# Altium schematic sheet Peripherals.SchDoc
size A3; PageSetup: Record=PageOptions|CenterHorizontal=True|CenterVertical=True|PrintScale=0.49|XCorrection=1.00|YCorrection=1.00|PrintKind=0|BorderSize=5000000|LeftOffset=0|BottomOffset=0|Orientation=2|PaperLength=1000|PaperWidth=1000|Scale=100|PaperSource=7|PrintQuality=600|MediaType=1|DitherType=10|PaperKind=A3|PrintScaleMode=1; SheetTitle: Sheet Title
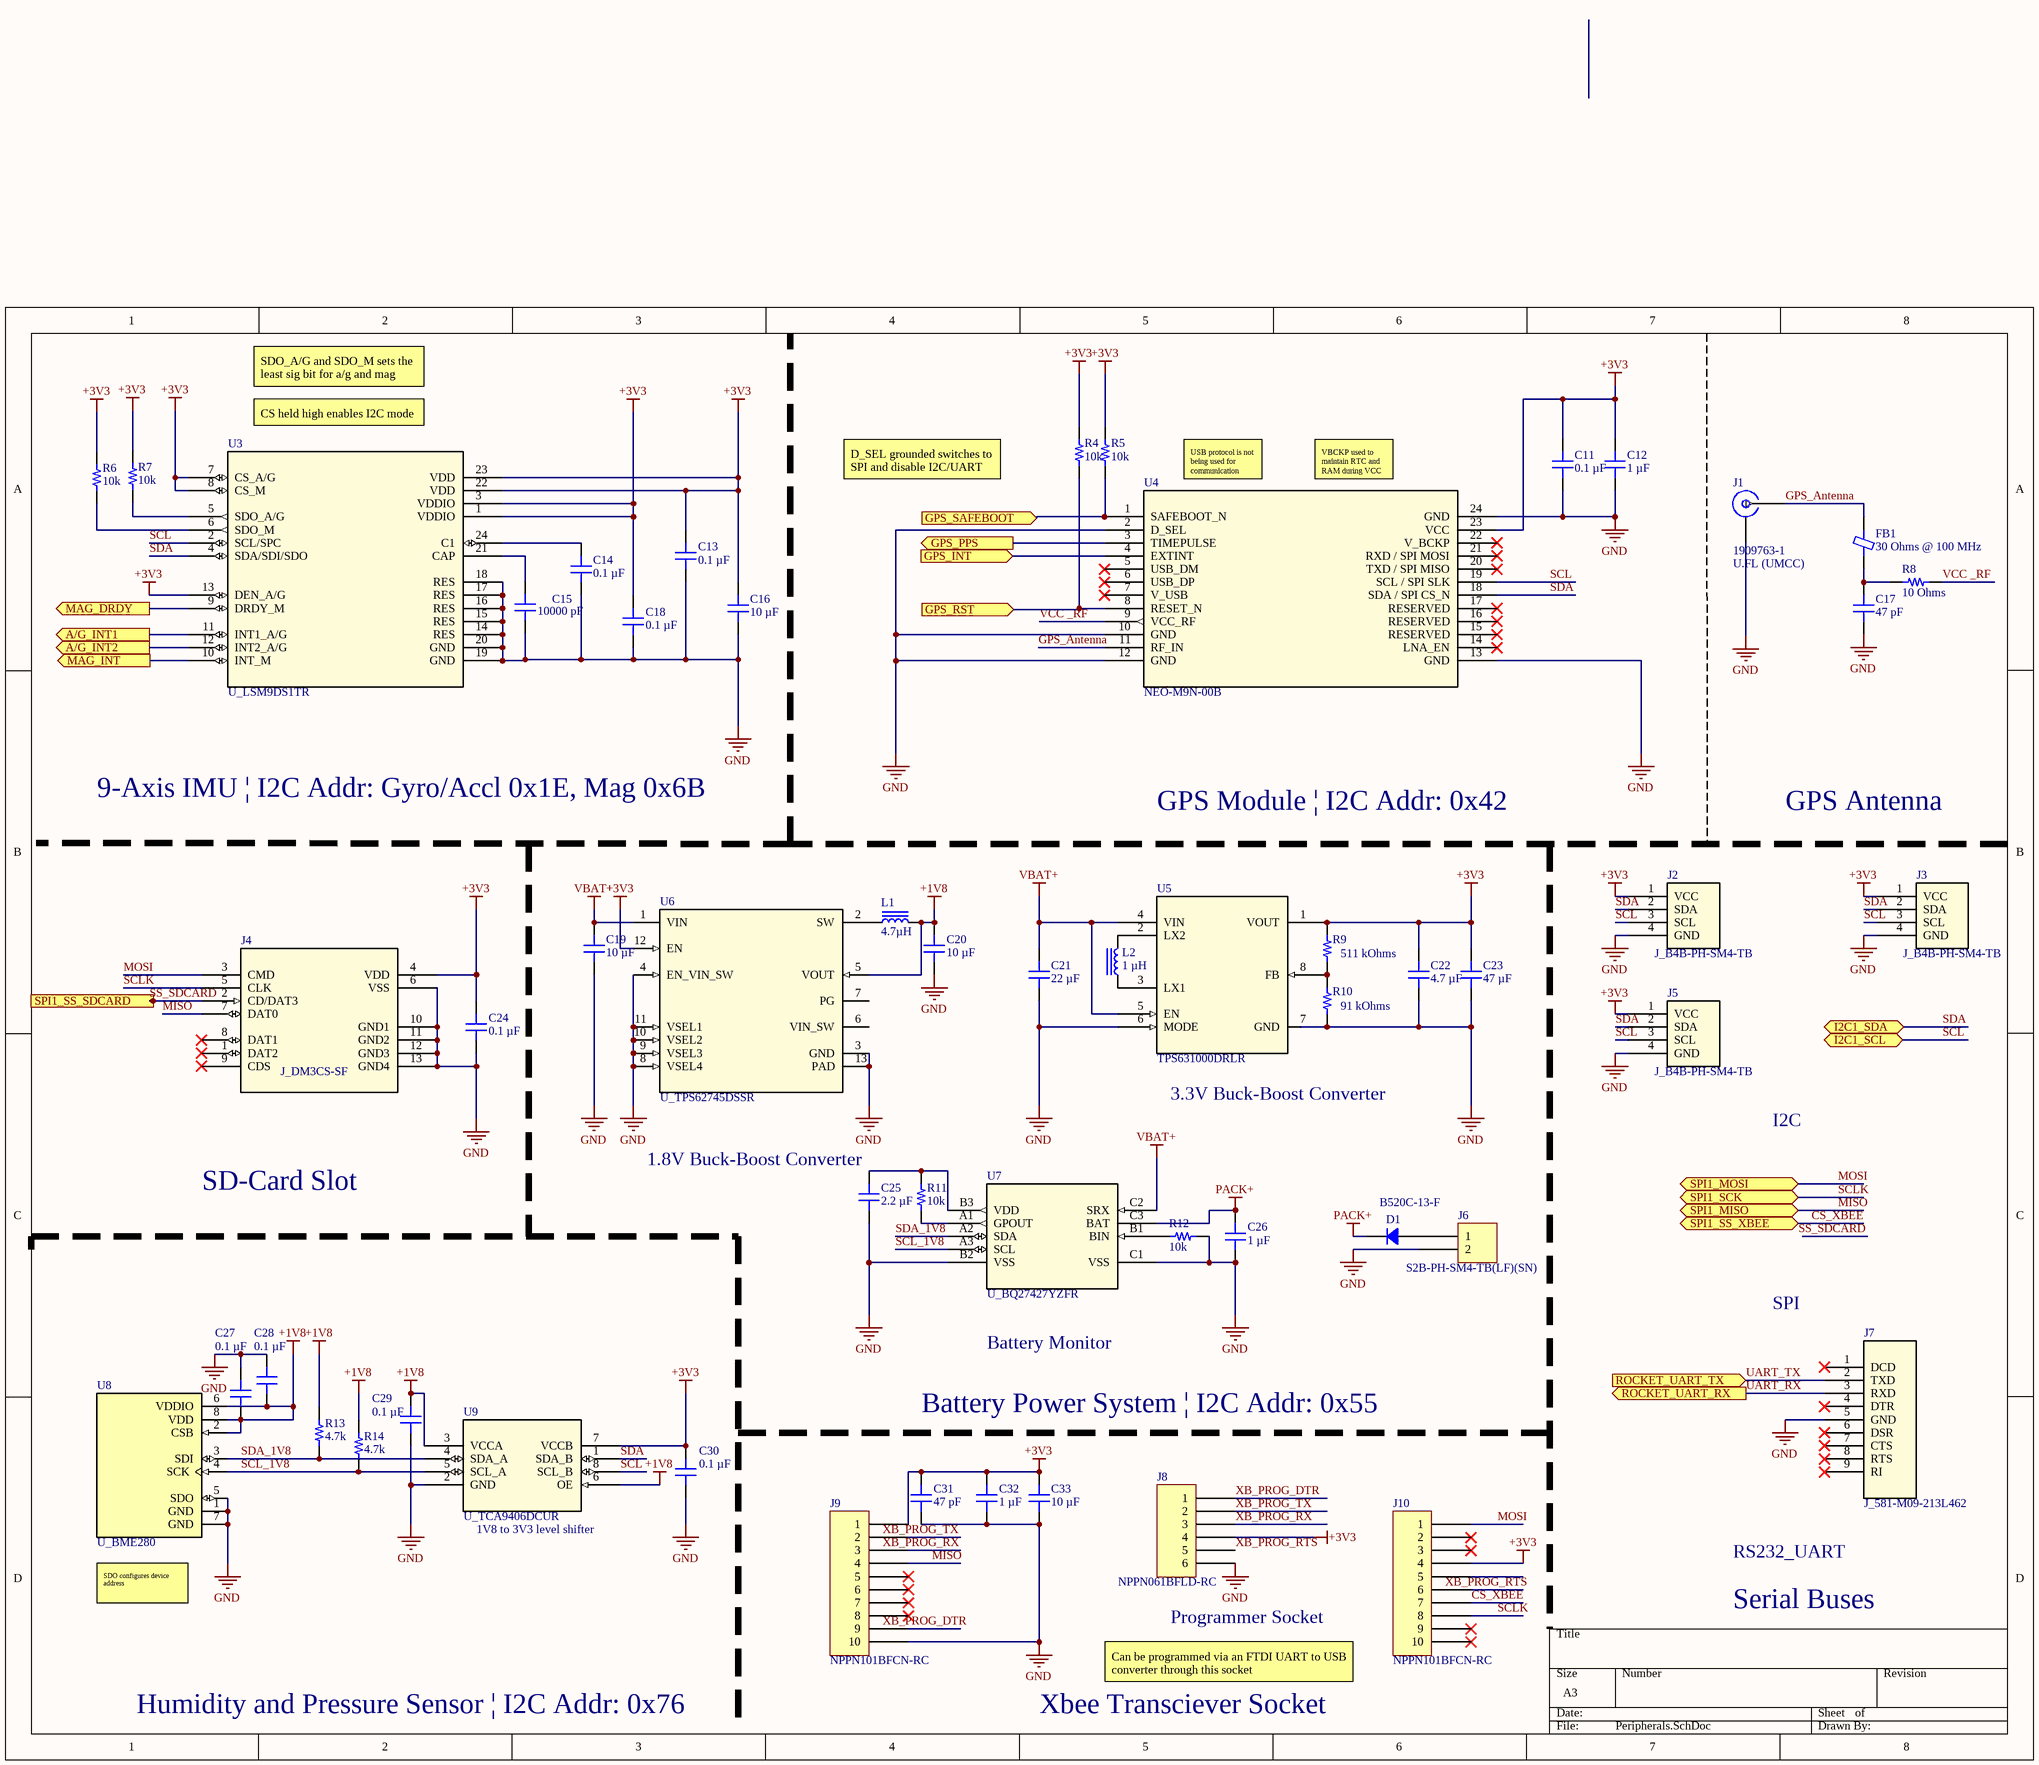
[diagram p0: Peripherals.SchDoc]

## Parts
C11  0.1 µF  [CAP 0402_1005]
C12  1 µF  [CAP 0402_1005]
C13  0.1 µF  [CAP 0201_0603]
C14  0.1 µF  [CAP 0402_1005]
C15  10000 pF  [CAP 0402_1005]
C16  10 µF  [CAP 0402_1005]
C17  47 pF  [CAP 0402_1005]
C18  0.1 µF  [CAP 0201_0603]
C19  10 µF  [CAP 0402_1005]
C20  10 µF  [CAP 0402_1005]
C21  22 µF  [CAP 0402_1005]
C22  4.7 µF  [CAP 0603_1608]
C23  47 µF  [CAP 0805_2012]
C24  0.1 µF  [CAP 0402_1005]
C25  2.2 µF  [CAP 0402_1005]
C26  1 µF  [CAP 0402_1005]
C27  0.1 µF  [CAP 0402_1005]
C28  0.1 µF  [CAP 0402_1005]
C29  0.1 µF  [CAP 0402_1005]
C30  0.1 µF  [CAP 0402_1005]
C31  47 pF  [CAP 0402_1005]
C32  1 µF  [CAP 0402_1005]
C33  10 µF  [CAP 0402_1005]
D1  B520C-13-F  [DO214AB SMC]
FB1  30 Ohms @ 100 MHz  [FER 0402_1005]
J1  1909763-1  Connector Style: U.FL (UMCC)  [TE C-1909763]
J2  J_B4B-PH-SM4-TB  [CONN_B4B-PH-SM4-TB_JST]
J3  J_B4B-PH-SM4-TB  [CONN_B4B-PH-SM4-TB_JST]
J4  J_DM3CS-SF  [DM3CS-SF_HIR]
J5  J_B4B-PH-SM4-TB  [CONN_B4B-PH-SM4-TB_JST]
J6  S2B-PH-SM4-TB(LF)(SN)  [JST S2B-PH-SM4-TB]
J7  J_581-M09-213L462  [CONN_581-M09-213L462_NRC]
J8  NPPN061BFLD-RC  [SULLINS NPPN061BFLD-RC]
J9  NPPN101BFCN-RC  [SULLINS NPPN101BFCN]
J10  NPPN101BFCN-RC  [SULLINS NPPN101BFCN]
L1  4.7µH  [IND 0603_1608 RF WW]
L2  1 µH  [IND 0806_2016]
R4  10k  [RES 0402_1005]
R5  10k  [RES 0402_1005]
R6  10k  [RES 0402_1005]
R7  10k  [RES 0402_1005]
R8  10 Ohms  [RES 0402_1005]
R9  511 kOhms  [RES 0402_1005]
R10  91 kOhms  [RES 0402_1005]
R11  10k  [RES 0402_1005]
R12  10k  [RES 0402_1005]
R13  4.7k  [RES 0201_0603]
R14  4.7k  [RES 0201_0603]
U3  U_LSM9DS1TR  [LGA-24_3X3P5X1_STM]
U4  NEO-M9N-00B  [XCVR_NEO-M9N-00B]
U5  TPS631000DRLR  [TPS631000DRLR_TEX]
U6  U_TPS62745DSSR  [DSS0012A]
U7  U_BQ27427YZFR  [DSBGA9-YZF_TEX]
U8  U_BME280  [BME280]
U9  U_TCA9406DCUR  [DCU8]

## Ports
A/G_INT1 (out), A/G_INT2 (out), GPS_INT (in), GPS_PPS (out), GPS_RST (in), GPS_SAFEBOOT (in), I2C1_SCL (bidir), I2C1_SDA (bidir), MAG_DRDY (out), MAG_INT (out), ROCKET_UART_RX (out), ROCKET_UART_TX (in), SPI1_MISO (bidir), SPI1_MOSI (bidir), SPI1_SCK (bidir), SPI1_SS_SDCARD (in), SPI1_SS_XBEE (bidir)

## Nets
+1V8: C20.2 C27.2 C28.2 C29.1 L1.2 R13.2 R14.2 U6.5(VOUT) U8.2(CSB) U8.6(VDDIO) U8.8(VDD) U9.3(VCCA) U9.6(OE)
+3V3: C11.1 C12.2 C13.2 C16.2 C18.2 C22.2 C23.2 C24.2 C30.1 C31.2 C32.2 C33.2 J2.1(VCC) J3.1(VCC) J4.4(VDD) J5.1(VCC) J8.4 J9.1 J10.4 R4.1 R5.1 R6.1 R7.1 R9.2 U3.1(VDDIO) U3.3(VDDIO) U3.7(CS_A/G) U3.8(CS_M) U3.13(DEN_A/G) U3.22(VDD) U3.23(VDD) U4.23(VCC) U5.1(VOUT) U6.12(EN) U9.7(VCCB)
GND: C11.2 C12.1 C13.1 C14.1 C15.1 C16.1 C17.1 C18.1 C19.1 C20.1 C21.1 C22.1 C23.1 C24.1 C25.1 C26.1 C27.1 C28.1 C29.2 C30.2 C31.1 C32.1 C33.1 J1.G(GND) J2.4(GND) J3.4(GND) J4.6(VSS) J4.10(GND1) J4.11(GND2) J4.12(GND3) J4.13(GND4) J5.4(GND) J6.2 J7.5(GND) J8.6 J9.10 R10.1 R12.1 U3.14(RES) U3.15(RES) U3.16(RES) U3.17(RES) U3.18(RES) U3.19(GND) U3.20(GND) U4.2(D_SEL) U4.10(GND) U4.12(GND) U4.13(GND) U4.24(GND) U5.6(MODE) U5.7(GND) U6.3(GND) U6.4(EN_VIN_SW) U6.8(VSEL4) U6.9(VSEL3) U6.10(VSEL2) U6.11(VSEL1) U6.13(PAD) U7.B2(VSS) U7.C1(VSS) U8.1(GND) U8.5(SDO) U8.7(GND) U9.2(GND)
PACK+: C26.2 D1.2 U7.C3(BAT)
VBAT+: C19.2 C21.2 U5.4(VIN) U5.5(EN) U6.1(VIN) U7.C2(SRX)
A/G_INT1: U3.11(INT1_A/G) ; port A/G_INT1
A/G_INT2: U3.12(INT2_A/G) ; port A/G_INT2
CS_XBEE: J10.7 ; port SPI1_SS_XBEE
GPS_Antenna: FB1.2 J1.S(SIGNAL) U4.11(RF_IN)
GPS_INT: U4.4(EXTINT) ; port GPS_INT
GPS_PPS: U4.3(TIMEPULSE) ; port GPS_PPS
GPS_RST: R4.2 U4.8(RESET_N) ; port GPS_RST
GPS_SAFEBOOT: R5.2 U4.1(SAFEBOOT_N) ; port GPS_SAFEBOOT
MAG_DRDY: U3.9(DRDY_M) ; port MAG_DRDY
MAG_INT: U3.10(INT_M) ; port MAG_INT
MISO: J4.7(DAT0) J9.4 ; port SPI1_MISO
MOSI: J4.3(CMD) J10.1 ; port SPI1_MOSI
SCL: J2.3(SCL) J3.3(SCL) J5.3(SCL) U3.2(SCL/SPC) U4.19(SCL_/_SPI_SLK) U9.8(SCL_B) ; port I2C1_SCL
SCL_1V8: R14.1 U7.A3(SCL) U8.4(SCK) U9.5(SCL_A)
SCLK: J4.5(CLK) J10.8 ; port SPI1_SCK
SDA: J2.2(SDA) J3.2(SDA) J5.2(SDA) U3.4(SDA/SDI/SDO) U4.18(SDA_/_SPI_CS_N) U9.1(SDA_B) ; port I2C1_SDA
SDA_1V8: R13.1 U7.A2(SDA) U8.3(SDI) U9.4(SDA_A)
SS_SDCARD: J4.2(CD/DAT3) ; port SPI1_SS_SDCARD
UART_RX: J7.3(RXD) ; port ROCKET_UART_RX
UART_TX: J7.2(TXD) ; port ROCKET_UART_TX
VCC _RF: R8.2 U4.9(VCC_RF)
XB_PROG_DTR: J8.1
XB_PROG_RTS: J8.5
XB_PROG_RX: J8.3
XB_PROG_TX: J8.2
NetC14_2: C14.2 U3.24(C1)
NetC15_2: C15.2 U3.21(CAP)
NetC17_2: C17.2 FB1.1 R8.1
NetC25_2: C25.2 R11.2 U7.B3(VDD)
NetD1_1: D1.1 J6.1
NetL1_1: L1.1 U6.2(SW)
NetL2_1: L2.1 U5.3(LX1)
NetL2_2: L2.2 U5.2(LX2)
NetR6_2: R6.2 U3.6(SDO_M)
NetR7_2: R7.2 U3.5(SDO_A/G)
NetR9_1: R9.1 R10.2 U5.8(FB)
NetR11_1: R11.1 U7.A1(GPOUT)
NetR12_2: R12.2 U7.B1(BIN)

Not connected (* = marked no-connect by the designer): J4 1(DAT2)* 8(DAT1)* 9(CDS)*; J7 1(DCD)* 4(DTR)* 6(DSR)* 7(CTS)* 8(RTS)* 9(RI)*; J9 2 3 5* 6* 7* 8* 9; J10 2* 3* 5 6 9* 10*; U4 5(USB_DM)* 6(USB_DP)* 7(V_USB)* 14(LNA_EN)* 15(RESERVED)* 16(RESERVED)* 17(RESERVED)* 20(TXD_/_SPI_MISO)* 21(RXD_/_SPI_MOSI)* 22(V_BCKP)*; U6 6(VIN_SW) 7(PG)

## Notes on the sheet
- SDO_A/G and SDO_M sets the least sig bit for a/g and mag
- CS held high enables I2C mode
- D_SEL grounded switches to SPI and disable I2C/UART
- (near U4) USB protocol is not being used for communication
- (near U4) VBCKP used to maintain RTC and RAM during VCC outage. Not being used as MCU does complete logging.
- 9-Axis IMU | I2C Addr: Gyro/Accl 0x1E, Mag 0x6B
- GPS Module | I2C Addr: 0x42
- GPS Antenna
- 3.3V Buck-Boost Converter
- I2C
- SD-Card Slot
- (near C25) 1.8V Buck-Boost Converter
- SPI
- Battery Monitor
- Battery Power System | I2C Addr: 0x55
- (near U9) 1V8 to 3V3 level shifter
- RS232_UART
- (near U8) SDO configures device address
- (near J8) Programmer Socket
- Serial Buses
- Humidity and Pressure Sensor | I2C Addr: 0x76
- Xbee Transciever Socket
- Can be programmed via an FTDI UART to USB converter through this socket
- Labels drawn without touching a wire or pin: SS_SDCARD, XB_PROG_DTR, XB_PROG_RTS, XB_PROG_RX, XB_PROG_TX

## Library data of the parts
C11 C14 C24 C27-C30 = CL05B104KP5VPNC: CAP CER 100NF 10V X7R 0402; manufacturer: Samsung Electro-Mechanics; Tolerance: ±10%; Part Number: CL05B104KP5VPNC; Value: 0.1 µF; Applications: Automotive; Capacitance: 0.1 µF; componentlink1description: Datasheet; componentlink1url: https://mm.digikey.com/Volume0/opasdata/d220001/medias/docus/5458/CL05B104KP5VPNC_Spec.pdf; componentlink2description: DigiKey Link; componentlink2url: https://www.digikey.com/en/products/detail/samsung-electro-mechanics/CL05B104KP5VPNC/20498482; Device Package: 0402 (1005 Metric); lastupdated: 9/02/2024 8:03:17 PM; Lifecycle Status: Active; Minimum Order: 1; Mounting Type: Surface Mount, MLCC; Operating Temperature: -55°C ~ 125°C; Package / Case: 0402 (1005 Metric); packaging: TapeAndReel; partid: 56690; price: 0.01; Ratings: AEC-Q200; series: CL; Size / Dimension: 0.039" L x 0.020" W (1.00mm x 0.50mm); Supplier 1: DigiKey; Supplier Part Number 1: 1276-CL05B104KP5VPNCCT-ND; Temperature Coefficient: X7R; Thickness (Max): 0.022" (0.55mm); Voltage - Rated: 10V
C12 C26 C32 = KGM05AR50G105KH: CAP CER 1UF 4V X5R 0402; manufacturer: KYOCERA AVX; Tolerance: ±10%; Part Number: KGM05AR50G105KH; Value: 1 µF; Applications: General Purpose; Capacitance: 1 µF; componentlink1description: Datasheet; componentlink1url: https://datasheets.kyocera-avx.com/cx5r.pdf; componentlink2description: DigiKey Link; componentlink2url: https://www.digikey.com/en/products/detail/kyocera-avx/KGM05AR50G105KH/3079858; Device Package: 0402 (1005 Metric); lastupdated: 9/02/2024 8:03:45 PM; Lifecycle Status: Active; Minimum Order: 1; Mounting Type: Surface Mount, MLCC; Operating Temperature: -55°C ~ 85°C; Package / Case: 0402 (1005 Metric); packaging: TapeAndReel; partid: 51052; Part Status: Active; price: 0.07; series: KGM - X5R; Size / Dimension: 0.039" L x 0.020" W (1.00mm x 0.50mm); Supplier 1: DigiKey; Supplier Part Number 1: 478-KGM05AR50G105KHCT-ND; Temperature Coefficient: X5R; Thickness (Max): 0.022" (0.55mm); Voltage - Rated: 4V
C13 C18 = 02016C104KAT2A: 0201 6.3V X7R 100NF 10%; manufacturer: KYOCERA AVX; Part Number: 02016C104KAT2A; Value: 0.1 µF; Applications: General Purpose; Capacitance: 0.1 µF; componentlink1description: Datasheet; componentlink1url: https://datasheets.kyocera-avx.com/X7RDielectric.pdf; componentlink2description: DigiKey Link; componentlink2url: https://www.digikey.com/en/products/detail/kyocera-avx/02016C104KAT2A/17868582; Device Package: 0201 (0603 Metric); lastupdated: 11/03/2024 7:01:34 AM; Lifecycle Status: Active; Minimum Order: 1; Mounting Type: Surface Mount, MLCC; Operating Temperature: -55°C ~ 125°C; Package / Case: 0201 (0603 Metric); packaging: TapeAndReel; partid: 47559; Part Status: Active; price: 0.06; series: -; Size / Dimension: 0.024" L x 0.012" W (0.60mm x 0.30mm); Supplier 1: DigiKey; Supplier Part Number 1: 478-02016C104KAT2ACT-ND; Temperature Coefficient: X7R; Thickness (Max): 0.013" (0.33mm); Tolerance: ±10%; Voltage - Rated: 6.3V
C15 = C0402C103K4REC7867: CAP CER 0402 10NF 16V X7R 10%; manufacturer: KEMET; Part Number: C0402C103K4REC7867; Value: 10000 pF; Applications: ESD Protection; Capacitance: 10000 pF; componentlink1description: Datasheet; componentlink1url: https://connect.kemet.com:7667/gateway/IntelliData-ComponentDocumentation/1.0/download/datasheet/C0402C103K4REC7867; componentlink2description: DigiKey Link; componentlink2url: https://www.digikey.com/en/products/detail/kemet/C0402C103K4REC7867/8643577; Device Package: 0402 (1005 Metric); lastupdated: 9/02/2024 8:03:43 PM; Lifecycle Status: Active; Minimum Order: 1; Mounting Type: Surface Mount, MLCC; Operating Temperature: -55°C ~ 125°C; Package / Case: 0402 (1005 Metric); packaging: TapeAndReel; partid: 52124; Part Status: Active; price: 0.01; series: ESD SMD Comm X7R; Size / Dimension: 0.039" L x 0.020" W (1.00mm x 0.50mm); Supplier 1: DigiKey; Supplier Part Number 1: 399-C0402C103K4REC7867CT-ND; Temperature Coefficient: X7R; Thickness (Max): 0.022" (0.55mm); Tolerance: ±10%; Voltage - Rated: 16V
C16 C19 C20 = GRM155R60G106ME01D: CAP CER 10UF 4V X5R 0402; manufacturer: Murata Electronics; Tolerance: ±20%; Part Number: GRM155R60G106ME01D; Value: 10 µF; Applications: General Purpose; Capacitance: 10 µF; componentlink1description: Datasheet; componentlink1url: https://search.murata.co.jp/Ceramy/image/img/A01X/G101/ENG/GRM155R60G106ME01-01A.pdf; componentlink2description: DigiKey Link; componentlink2url: https://www.digikey.com/en/products/detail/murata-electronics/GRM155R60G106ME01D/13688572; Device Package: 0402 (1005 Metric); lastupdated: 9/02/2024 8:03:59 PM; Lifecycle Status: Active; Minimum Order: 1; Mounting Type: Surface Mount, MLCC; Operating Temperature: -55°C ~ 85°C; Package / Case: 0402 (1005 Metric); packaging: TapeAndReel; partid: 48095; Part Status: Active; price: 0.01; series: GRM; Size / Dimension: 0.039" L x 0.020" W (1.00mm x 0.50mm); Supplier 1: DigiKey; Supplier Part Number 1: 490-GRM155R60G106ME01DCT-ND; Temperature Coefficient: X5R; Thickness (Max): 0.026" (0.65mm); Voltage - Rated: 4V
C17 C31 = C0402C470J4GAC7867: CAP CER 47PF 16V NP0 0402; manufacturer: KEMET; Temperature Coefficient: C0G, NP0; Tolerance: ±5%; Part Number: C0402C470J4GAC7867; Value: 47 pF; Applications: General Purpose; Capacitance: 47 pF; componentlink1description: Datasheet; componentlink1url: https://api.kemet.com/component-edge/download/datasheet/C0402C470J4GACTU.pdf; componentlink2description: DigiKey Link; componentlink2url: https://www.digikey.com/en/products/detail/kemet/C0402C470J4GAC7867/2196712; Device Package: 0402 (1005 Metric); Features: Low ESL; lastupdated: 9/02/2024 8:04:38 PM; Lifecycle Status: Active; Minimum Order: 1; Mounting Type: Surface Mount, MLCC; Operating Temperature: -55°C ~ 125°C; Package / Case: 0402 (1005 Metric); packaging: TapeAndReel; partid: 1744; Part Status: Active; price: 0.05; series: SMD Comm C0G; Size / Dimension: 0.039" L x 0.020" W (1.00mm x 0.50mm); Supplier 1: DigiKey; Supplier Part Number 1: 399-14453-1-ND; Thickness (Max): 0.022" (0.55mm); Voltage - Rated: 16V
C21 = GRM158R61A226ME15D: CAP CER 22UF 10V X5R 0402; manufacturer: Murata Electronics; Tolerance: ±20%; Part Number: GRM158R61A226ME15D; Value: 22 µF; Applications: General Purpose; Capacitance: 22 µF; componentlink1description: Datasheet; componentlink1url: https://search.murata.co.jp/Ceramy/image/img/A01X/G101/ENG/GRM158R61A226ME15-01A.pdf; componentlink2description: DigiKey Link; componentlink2url: https://www.digikey.com/en/products/detail/murata-electronics/GRM158R61A226ME15D/16033379; Device Package: 0402 (1005 Metric); lastupdated: 9/02/2024 8:04:08 PM; Lifecycle Status: Active; Minimum Order: 1; Mounting Type: Surface Mount, MLCC; Operating Temperature: -55°C ~ 85°C; Package / Case: 0402 (1005 Metric); packaging: TapeAndReel; partid: 44973; Part Status: Active; price: 0.08; series: GRM; Size / Dimension: 0.039" L x 0.020" W (1.00mm x 0.50mm); Supplier 1: DigiKey; Supplier Part Number 1: 490-GRM158R61A226ME15DCT-ND; Temperature Coefficient: X5R; Thickness (Max): 0.031" (0.80mm); Voltage - Rated: 10V
C22 = GRM185C80J475ME11D: CAP CER 4.7UF 6.3V X6S 0603; manufacturer: Murata Electronics; Tolerance: ±20%; Part Number: GRM185C80J475ME11D; Value: 4.7 µF; Applications: General Purpose; Capacitance: 4.7 µF; componentlink1description: Datasheet; componentlink1url: https://search.murata.co.jp/Ceramy/image/img/A01X/G101/ENG/GRM185C80J475ME11-01A.pdf; componentlink2description: DigiKey Link; componentlink2url: https://www.digikey.com/en/products/detail/murata-electronics/GRM185C80J475ME11D/10326313; Device Package: 0603 (1608 Metric); lastupdated: 9/02/2024 8:10:28 PM; Lifecycle Status: Active; Minimum Order: 1; Mounting Type: Surface Mount, MLCC; Operating Temperature: -55°C ~ 105°C; Package / Case: 0603 (1608 Metric); packaging: TapeAndReel; partid: 3976; Part Status: Active; price: 0.03; series: GRM; Size / Dimension: 0.063" L x 0.031" W (1.60mm x 0.80mm); Supplier 1: DigiKey; Supplier Part Number 1: 490-18660-1-ND; Temperature Coefficient: X6S; Thickness (Max): 0.022" (0.55mm); Voltage - Rated: 6.3V
C23 = AMK212BBJ476MD-T: CAP CER 47UF 4V X5R 0805; manufacturer: Taiyo Yuden; Tolerance: ±20%; Part Number: AMK212BBJ476MD-T; Value: 47 µF; Applications: SMPS Filtering; Capacitance: 47 µF; componentlink1description: Datasheet; componentlink1url: https://ds.yuden.co.jp/TYCOMPAS/ut/detail?pn=AMK212BBJ476MD-T &u=M; componentlink2description: DigiKey Link; componentlink2url: https://www.digikey.com/en/products/detail/taiyo-yuden/AMK212BBJ476MD-T/7066986; Device Package: 0805 (2012 Metric); lastupdated: 9/02/2024 8:16:07 PM; Lifecycle Status: Active; Minimum Order: 1; Mounting Type: Surface Mount, MLCC; Operating Temperature: -55°C ~ 85°C; Package / Case: 0805 (2012 Metric); packaging: TapeAndReel; partid: 3321; Part Status: Active; price: 0.12; series: M; Size / Dimension: 0.079" L x 0.049" W (2.00mm x 1.25mm); Supplier 1: DigiKey; Supplier Part Number 1: 587-5399-1-ND; Temperature Coefficient: X5R; Thickness (Max): 0.037" (0.95mm); Voltage - Rated: 4V
C25 = GRM155R6YA225KE11D: CAP CER 2.2UF 35V X5R 0402; manufacturer: Murata Electronics; Tolerance: ±10%; Part Number: GRM155R6YA225KE11D; Value: 2.2 µF; Applications: General Purpose; Capacitance: 2.2 µF; componentlink1description: Datasheet; componentlink1url: https://search.murata.co.jp/Ceramy/image/img/A01X/G101/ENG/GRM155R6YA225KE11-01.pdf; componentlink2description: DigiKey Link; componentlink2url: https://www.digikey.com/en/products/detail/murata-electronics/GRM155R6YA225KE11D/9867920; Device Package: 0402 (1005 Metric); lastupdated: 9/02/2024 8:04:37 PM; Lifecycle Status: Active; Minimum Order: 1; Mounting Type: Surface Mount, MLCC; Operating Temperature: -55°C ~ 85°C; Package / Case: 0402 (1005 Metric); packaging: TapeAndReel; partid: 1989; Part Status: Active; price: 0.03; series: GRM; Size / Dimension: 0.039" L x 0.020" W (1.00mm x 0.50mm); Supplier 1: DigiKey; Supplier Part Number 1: 490-18212-1-ND; Temperature Coefficient: X5R; Thickness (Max): 0.028" (0.70mm); Voltage - Rated: 35V
C33 = CL05A106MP8NUB8: CAP CER 10UF 10V X5R 0402; manufacturer: Samsung Electro-Mechanics; Tolerance: ±20%; Part Number: CL05A106MP8NUB8; Value: 10 µF; Applications: Acoustic Noise Reduction; Capacitance: 10 µF; componentlink1description: Datasheet; componentlink1url: http://www.samsungsem.com/kr/support/product-search/mlcc/CL05A106MP8NUB8.jsp; componentlink2description: DigiKey Link; componentlink2url: https://www.digikey.com/en/products/detail/samsung-electro-mechanics/CL05A106MP8NUB8/5961314; Device Package: 0402 (1005 Metric); lastupdated: 9/02/2024 8:04:38 PM; Lifecycle Status: Active; Minimum Order: 1; Mounting Type: Surface Mount, MLCC; Operating Temperature: -55°C ~ 85°C; Package / Case: 0402 (1005 Metric); packaging: TapeAndReel; partid: 1758; Part Status: Active; price: 0.06; series: CL; Size / Dimension: 0.039" L x 0.020" W (1.00mm x 0.50mm); Supplier 1: DigiKey; Supplier Part Number 1: 1276-6830-1-ND; Temperature Coefficient: X5R; Thickness (Max): 0.035" (0.90mm); Voltage - Rated: 10V
D1 = B520C-13-F: DIODE SCHOTTKY 20V 5A SMC; Manufacturer: Diodes Incorporated; Capacitance @ Vr, F: 300pF @ 4V, 1MHz; Current - Reverse Leakage @ Vr: 500 µA @ 20 V; Speed: Fast Recovery =< 500ns, > 200mA (Io); Voltage - Forward (Vf) (Max) @ If: 550 mV @ 5 A; Part Number: B520C-13-F; ComponentLink1Description: Datasheet; ComponentLink1URL: https://www.diodes.com/assets/Datasheets/ds13012.pdf; ComponentLink2Description: DigiKey Link; ComponentLink2URL: https://www.digikey.com/en/products/detail/diodes-incorporated/B520C-13-F/806535; Current - Average Rectified (Io): 5A; Diode Type: Schottky; LastUpdated: 11/03/2024 7:45:58 AM; Lifecycle Status: Active; Minimum Order: 1; Mounting Type: Surface Mount; Operating Temperature - Junction: -55°C ~ 150°C; Package / Case: DO-214AB, SMC; Packaging: TapeAndReel; PartId: 1720; Part Status: Active; Price: 0.16; Series: -; Supplier 1: DigiKey; Supplier Part Number 1: B520C-FDICT-ND; Supplier Device Package: SMC; Voltage - DC Reverse (Vr) (Max): 20 V
FB1 = BLM15PE300SH1D: FERRITE BEAD 30 OHM 0402 1LN; Manufacturer: Murata Electronics; Current Rating (Max): 2.3A; DC Resistance (DCR) (Max): 35mOhm; Filter Type: Power Line; Number of Lines: 1; Part Number: BLM15PE300SH1D; ComponentLink1Description: Datasheet; ComponentLink1URL: https://www.murata.com/products/productdata/8796743696414/QNFA9103.pdf; ComponentLink2Description: DigiKey Link; ComponentLink2URL: https://www.digikey.com/en/products/detail/murata-electronics/BLM15PE300SH1D/14012391; Device Package: 0402 (1005 Metric); Height (Max): 0.022" (0.55mm); Impedance @ Frequency: 30 Ohms @ 100 MHz; LastUpdated: 11/03/2024 7:42:36 AM; Lifecycle Status: Active; Minimum Order: 1; Mounting Type: Surface Mount; Operating Temperature: -55°C ~ 125°C; Package / Case: 0402 (1005 Metric); Packaging: TapeAndReel; PartId: 2564; Part Status: Active; Price: 0.07; Ratings: AEC-Q200; Series: BLM; Size / Dimension: 0.039" L x 0.020" W (1.00mm x 0.50mm); Supplier 1: DigiKey; Supplier Part Number 1: 490-BLM15PE300SH1DCT-ND; Value: 30 Ohms @ 100 MHz
J1 = 1909763-1: CONN UMCC JACK STR 50OHM SMD; Manufacturer: TE Connectivity AMP Connectors; Connector Type: Jack, Male Pin; Contact Termination: Solder; Frequency - Max: 6 GHz; Number of Ports: 1; Part Number: 1909763-1; ComponentLink1Description: Datasheet; ComponentLink1URL: https://www.te.com/commerce/DocumentDelivery/DDEController?Action=srchrtrv&DocNm=1909763&DocType=Customer+Drawing&DocLang=English; ComponentLink2Description: DigiKey Link; ComponentLink2URL: https://www.digikey.com/en/products/detail/te-connectivity-amp-connectors/1909763-1/4731728; Fastening Type: Snap-On; Housing Color: Ivory; Impedance: 50Ohm; LastUpdated: 29/06/2022 6:17:07 PM; Lifecycle Status: Active; Minimum Order: 1; Mounting Type: Surface Mount; Packaging: TapeAndReel; Part Status: Active; Price: 0.23; Series: -; Shield Termination: Solder; Supplier 1: DigiKey; Supplier Part Number 1: A118077CT-ND
J2 J3 J5 = J_B4B-PH-SM4-TB: No Description Available; Mfr_Name: JST; RefDes: RefDes; Type: Type
J4 = J_DM3CS-SF: No Description Available; Mfr_Name: Hirose; RefDes: RefDes; Type: Type
J6 = S2B-PH-SM4-TB(LF)(SN): CONN HEADER SMD R/A 2POS 2MM; Manufacturer: JST Sales America Inc.; Contact Length - Mating: 0.130" (3.30mm); Current Rating (Amps): 2A; Material Flammability Rating: UL94 V-0; Number of Positions: 2; Number of Positions Loaded: All; Pitch - Mating: 0.079" (2.00mm); Shrouding: Shrouded - 4 Wall; Style: Board to Cable/Wire; Voltage Rating: 100V; Part Number: S2B-PH-SM4-TB(LF)(SN); ComponentLink1Description: Datasheet; ComponentLink1URL: http://www.jst-mfg.com/product/pdf/eng/ePH.pdf; ComponentLink2Description: DigiKey Link; ComponentLink2URL: http://digikey.com/product-detail/en/jst-sales-america-inc/S2B-PH-SM4-TB-LF-SN/455-1749-1-ND/926846; Connector Type: Header; Contact Finish - Mating: Tin; Contact Finish - Post: Tin; Contact Material: Copper Alloy; Contact Shape: Square; Contact Type: Male Pin; Fastening Type: Detent Lock; Features: Solder Retention; Insulation Color: Natural; Insulation Height: 0.217" (5.51mm); Insulation Material: Polyamide (PA6T), Nylon 6T; LastUpdated: 15/01/2020 3:45:11 AM; Lifecycle Status: Active; Minimum Order: 1; Mounting Type: Surface Mount, Right Angle; Number of Rows: 1; Operating Temperature: -25°C ~ 85°C; Packaging: TapeAndReel; PartId: 115; Part Status: Active; Price: 0.27; Series: PH; Supplier 1: DigiKey; Supplier Part Number 1: 455-1749-1-ND; Termination: Solder
J7 = J_581-M09-213L462: 9 Position D-Type, Micro-D Receptacle, Female Sockets Connector; Mfr_Name: Norcomp Inc.; RefDes: RefDes; Type: Type
J8 = NPPN061BFLD-RC: CONN HDR 6POS 0.079 GOLD SMD; Manufacturer: Sullins Connector Solutions; Connector Type: Header; Current Rating (Amps): 2A; Material Flammability Rating: UL94 V-0; Number of Positions: 6; Number of Positions Loaded: All; Pitch - Mating: 0.079" (2.00mm); Style: Board to Board; Part Number: NPPN061BFLD-RC; ComponentLink1Description: Datasheet; ComponentLink1URL: https://drawings-pdf.s3.amazonaws.com/10489.pdf; ComponentLink2Description: DigiKey Link; ComponentLink2URL: https://www.digikey.com/en/products/detail/sullins-connector-solutions/NPPN061BFLD-RC/807233; Contact Finish - Mating: Gold; Contact Finish - Post: Gold; Contact Finish Thickness - Mating: Flash; Contact Type: Female Socket; Fastening Type: Push-Pull; Insulation Color: Black; Insulation Height: 0.181" (4.60mm); LastUpdated: 21/06/2022 3:41:40 PM; Lifecycle Status: Active; Minimum Order: 1; Mounting Type: Surface Mount; Number of Rows: 1; Operating Temperature: -40°C ~ 105°C; Packaging: Tube; Part Status: Active; Price: 0.45; Series: -; Supplier 1: DigiKey; Supplier Part Number 1: S5902-06-ND; Termination: Solder
J9 J10 = NPPN101BFCN-RC: CONN HDR 10POS 0.079 GOLD PCB; Manufacturer: Sullins Connector Solutions; Connector Type: Header; Contact Length - Post: 0.094" (2.40mm); Current Rating (Amps): 2A; Material Flammability Rating: UL94 V-0; Number of Positions: 10; Number of Positions Loaded: All; Pitch - Mating: 0.079" (2.00mm); Style: Board to Board; Part Number: NPPN101BFCN-RC; ComponentLink1Description: Datasheet; ComponentLink1URL: https://drawings-pdf.s3.amazonaws.com/10483.pdf; ComponentLink2Description: DigiKey Link; ComponentLink2URL: https://www.digikey.com/en/products/detail/sullins-connector-solutions/NPPN101BFCN-RC/804812; Contact Finish - Mating: Gold; Contact Finish - Post: Gold; Contact Finish Thickness - Mating: Flash; Contact Type: Female Socket; Fastening Type: Push-Pull; Insulation Color: Black; Insulation Height: 0.173" (4.40mm); LastUpdated: 21/06/2022 2:44:28 PM; Lifecycle Status: Active; Minimum Order: 1; Mounting Type: Through Hole; Number of Rows: 1; Operating Temperature: -40°C ~ 105°C; Packaging: Tube; Part Status: Active; Price: 0.49; Series: -; Supplier 1: DigiKey; Supplier Part Number 1: S5751-10-ND; Termination: Solder
L1 = AISC-0603F-4R7J-T: FIXED IND 4.7UH 160MA 2.7 OHM; Manufacturer: Abracon LLC; DC Resistance (DCR): 2.7Ohm Max; Frequency - Self Resonant: 50MHz; Inductance Frequency - Test: 7.9MHz; Material - Core: Ferrite; Shielding: Unshielded; Tolerance: ±5%; Type: Wirewound; Part Number: AISC-0603F-4R7J-T; ComponentLink1Description: Datasheet; ComponentLink1URL: https://abracon.com/Magnetics/inductors/AISC-0603F.pdf; ComponentLink2Description: DigiKey Link; ComponentLink2URL: http://digikey.com/product-detail/en/abracon-llc/AISC-0603F-4R7J-T/535-12533-1-ND/4864676; Current Rating (Amps): 160mA; Device Package: 0603 (1608 Metric); Height - Seated (Max): 0.047" (1.20mm); Inductance: 4.7µH; LastUpdated: 6/09/2020 11:05:20 AM; Lifecycle Status: Active; Minimum Order: 1; Mounting Type: Surface Mount; Operating Temperature: -40°C ~ 85°C; Package / Case: 0603 (1608 Metric); Packaging: TapeAndReel; PartId: 1356; Part Status: Active; Price: 0.19; Series: AISC-0603F; Size / Dimension: 0.063" L x 0.039" W (1.60mm x 1.00mm); Supplier 1: DigiKey; Supplier Part Number 1: 535-12533-1-ND; Supplier Device Package: 0603 (1608 Metric); Value: 4.7µH
L2 = LQM2MPN1R0NG0L: FIXED IND 1UH 1.4A 107 MOHM SMD; Manufacturer: Murata Electronics; DC Resistance (DCR): 107mOhm Max; Frequency - Self Resonant: 60MHz; Inductance Frequency - Test: 1 MHz; Material - Core: Ferrite; Shielding: Shielded; Tolerance: ±30%; Type: Multilayer; Part Number: LQM2MPN1R0NG0L; ComponentLink1Description: Datasheet; ComponentLink1URL: https://search.murata.co.jp/Ceramy/image/img/P02/JELF243B-0022.pdf; ComponentLink2Description: DigiKey Link; ComponentLink2URL: https://www.digikey.com/en/products/detail/murata-electronics/LQM2MPN1R0NG0L/4358097; Current Rating (Amps): 1.4 A; Device Package: 0806 (2016 Metric); Height - Seated (Max): 0.039" (1.00mm); Inductance: 1 µH; LastUpdated: 11/03/2024 8:03:14 AM; Lifecycle Status: Active; Minimum Order: 1; Mounting Type: Surface Mount; Operating Temperature: -55°C ~ 125°C; Package / Case: 0806 (2016 Metric); Packaging: TapeAndReel; PartId: 3771; Part Status: Active; Price: 0.07; Series: LQM2; Size / Dimension: 0.079" L x 0.063" W (2.00mm x 1.60mm); Supplier 1: DigiKey; Supplier Part Number 1: 490-7784-1-ND; Supplier Device Package: 0806 (2016 Metric); Value: 1 µH
R4-R7 R11 R12 = RP73PF1E10KBTD: RES 10K OHM 0.1% 1/10W 0402; Manufacturer: TE Connectivity Passive Product; Power (Watts): 0.1W, 1/10W; Resistance: 10 kOhms; Temperature Coefficient: ±25ppm/°C; Part Number: RP73PF1E10KBTD; Value: 10k; ComponentLink1Description: Datasheet; ComponentLink1URL: https://www.te.com/commerce/DocumentDelivery/DDEController?Action=srchrtrv&DocNm=1773272&DocType=DS&DocLang=English; ComponentLink2Description: DigiKey Link; ComponentLink2URL: https://www.digikey.com/en/products/detail/te-connectivity-passive-product/RP73PF1E10KBTD/8260957; Composition: Thin Film; Device Package: 0402 (1005 Metric); Height - Seated (Max): 0.014" (0.35mm); LastUpdated: 9/02/2024 8:30:24 PM; Lifecycle Status: Active; Minimum Order: 1; Number of Terminations: 2; Operating Temperature: -55°C ~ 155°C; Package / Case: 0402 (1005 Metric); Packaging: TapeAndReel; PartId: 2434; Part Status: Active; Price: 0.08; Series: RP73, Holsworthy; Size / Dimension: 0.039" L x 0.020" W (1.00mm x 0.50mm); Supplier 1: DigiKey; Supplier Part Number 1: A127415CT-ND; Supplier Device Package: 0402; Tolerance: ±0.1%
R8 = SR0402JR-7W10RP: TOTAL LEAD-FREE CHIP RESISTOR SU; Manufacturer: Yageo; Power (Watts): 0.125W, 1/8W; Temperature Coefficient: ±200ppm/°C; Tolerance: ±5%; Part Number: SR0402JR-7W10RP; Value: 10 Ohms; ComponentLink1Description: Datasheet; ComponentLink1URL: https://www.yageo.com/upload/media/product/productsearch/datasheet/rchip/PYu-SR_D_F%20tol_RoHS_L_5.pdf; ComponentLink2Description: DigiKey Link; ComponentLink2URL: https://www.digikey.com/en/products/detail/yageo/SR0402JR-7W10RP/15220089; Composition: Thick Film; Device Package: 0402 (1005 Metric); Features: Automotive AEC-Q200, Pulse Withstanding; Height - Seated (Max): 0.016" (0.40mm); LastUpdated: 9/02/2024 8:28:48 PM; Lifecycle Status: Active; Minimum Order: 1; Number of Terminations: 2; Operating Temperature: -55°C ~ 155°C; Package / Case: 0402 (1005 Metric); Packaging: TapeAndReel; PartId: 68859; Part Status: Active; Price: 0.11; Ratings: AEC-Q200; Resistance: 10 Ohms; Series: SR; Size / Dimension: 0.039" L x 0.020" W (1.00mm x 0.50mm); Supplier 1: DigiKey; Supplier Part Number 1: 13-SR0402JR-7W10RPCT-ND; Supplier Device Package: 0402
R9 = CRCW0402511KFKED: RES SMD 511K OHM 1% 1/16W 0402; Manufacturer: Vishay Dale; Power (Watts): 0.063W, 1/16W; Temperature Coefficient: ±100ppm/°C; Part Number: CRCW0402511KFKED; Value: 511 kOhms; ComponentLink1Description: Datasheet; ComponentLink1URL: http://www.vishay.com/docs/20035/dcrcwe3.pdf; ComponentLink2Description: DigiKey Link; ComponentLink2URL: https://www.digikey.com/en/products/detail/vishay-dale/CRCW0402511KFKED/1178316; Composition: Thick Film; Device Package: 0402 (1005 Metric); Features: Automotive AEC-Q200; Height - Seated (Max): 0.016" (0.40mm); LastUpdated: 9/02/2024 8:29:43 PM; Lifecycle Status: Active; Minimum Order: 1; Number of Terminations: 2; Operating Temperature: -55°C ~ 155°C; Package / Case: 0402 (1005 Metric); Packaging: TapeAndReel; PartId: 14529; Part Status: Active; Price: 0.01; Ratings: AEC-Q200; Resistance: 511 kOhms; Series: CRCW; Size / Dimension: 0.039" L x 0.020" W (1.00mm x 0.50mm); Supplier 1: DigiKey; Supplier Part Number 1: 541-511KLCT-ND; Supplier Device Package: 0402; Tolerance: ±1%
R10 = CRCW040291K0JNED: RES SMD 91K OHM 5% 1/16W 0402; Manufacturer: Vishay Dale; Power (Watts): 0.063W, 1/16W; Temperature Coefficient: ±200ppm/°C; Part Number: CRCW040291K0JNED; Value: 91 kOhms; ComponentLink1Description: Datasheet; ComponentLink1URL: http://www.vishay.com/docs/20035/dcrcwe3.pdf; ComponentLink2Description: DigiKey Link; ComponentLink2URL: https://www.digikey.com/en/products/detail/vishay-dale/CRCW040291K0JNED/1177615; Composition: Thick Film; Device Package: 0402 (1005 Metric); Features: Automotive AEC-Q200; Height - Seated (Max): 0.016" (0.40mm); LastUpdated: 9/02/2024 8:29:47 PM; Lifecycle Status: Active; Minimum Order: 1; Number of Terminations: 2; Operating Temperature: -55°C ~ 155°C; Package / Case: 0402 (1005 Metric); Packaging: CutTape; PartId: 13058; Part Status: Active; Price: 0.01; Ratings: AEC-Q200; Resistance: 91 kOhms; Series: CRCW; Size / Dimension: 0.039" L x 0.020" W (1.00mm x 0.50mm); Supplier 1: DigiKey; Supplier Part Number 1: 541-91KJCT-ND; Supplier Device Package: 0402; Tolerance: ±5%
R13 R14 = CRCW02014K70FKED: RES SMD 4.7K OHM 1% 1/20W 0201; Manufacturer: Vishay Dale; Power (Watts): 0.05W, 1/20W; Resistance: 4.7 kOhms; Temperature Coefficient: ±100ppm/°C; Part Number: CRCW02014K70FKED; Value: 4.7k; ComponentLink1Description: Datasheet; ComponentLink1URL: http://www.vishay.com/docs/20052/crcw0201e3.pdf; ComponentLink2Description: DigiKey Link; ComponentLink2URL: https://www.digikey.com/en/products/detail/vishay-dale/CRCW02014K70FKED/1968069; Composition: Thick Film; Device Package: 0201 (0603 Metric); Height - Seated (Max): 0.010" (0.26mm); LastUpdated: 11/03/2024 7:14:07 AM; Lifecycle Status: Active; Minimum Order: 1; Number of Terminations: 2; Operating Temperature: -55°C ~ 155°C; Package / Case: 0201 (0603 Metric); Packaging: TapeAndReel; PartId: 37; Part Status: Active; Price: 0.02; Series: CRCW; Size / Dimension: 0.024" L x 0.012" W (0.60mm x 0.30mm); Supplier 1: DigiKey; Supplier Part Number 1: 541-4.70KAABCT-ND; Supplier Device Package: 0201; Tolerance: ±1%
U3 = U_LSM9DS1TR: No Description Available; Mfr_Name: STMicroelectronics; RefDes: RefDes; Type: Type
U4 = U_NEO-M9N-00B: *; Mfr_Name: Ublox; RefDes: RefDes; Type: Type
U5 = TPS631000DRLR: Non-Isolated PoL Module DC DC Converter 1 Output 1.2 ~ 5.3V 2A 1.6V - 5.5V Input; Mfr_Name: Texas Instruments; RefDes: RefDes; Type: Type
U6 = U_TPS62745DSSR: No Description Available; Mfr_Name: Texas Instruments; Alternate_PartNumber: TPS62745DSST; CompType: IC; TYPE: TYPE; RefDes: RefDes; Application_BuildNumber: *; PartNumber: TPS62745DSSR; PackageReference: DSS0012A; MountType: SMT; RoHS: Y; Manufacturer: Texas Instruments
U7 = U_BQ27427YZFR: No Description Available; Mfr_Name: Texas Instruments; RefDes: RefDes; Type: Type
U8 = U_BME280: Humidity, Pressure, Temperature 0 ~ 100% RH I2C, SPI ±3% 1 s Surface Mount; Package: None; Availability: Unavailable; MP: BME280; Value: *; Price: None
U9 = U_TCA9406DCUR: No Description Available; Mfr_Name: Texas Instruments; RefDes: RefDes; Type: Type